# EAGLE design STM32 Proto Shield (EAGLE 9.6.2)
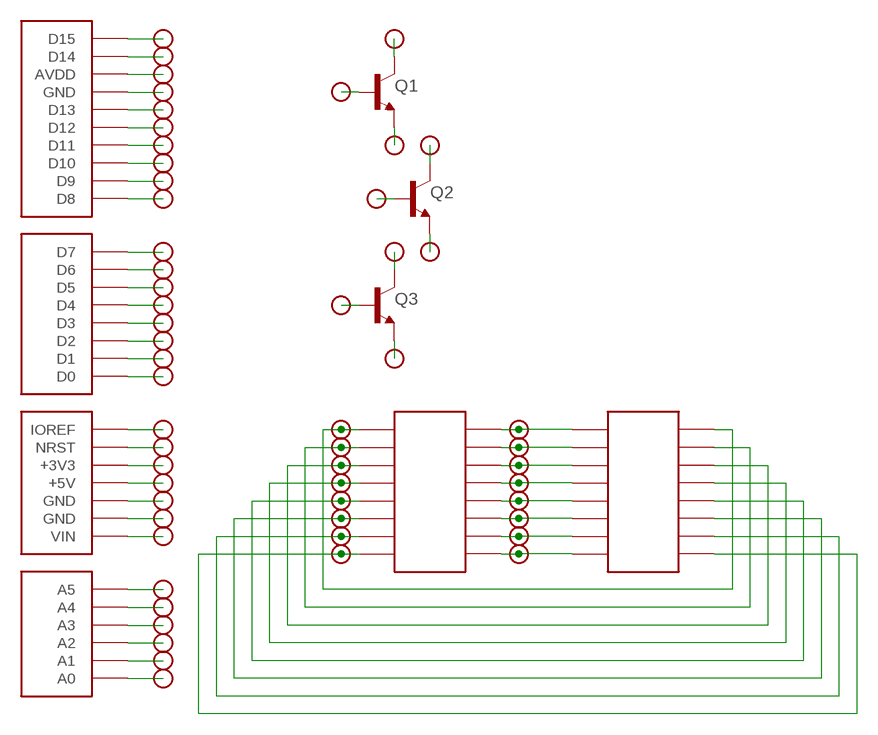
[diagram p0: schematic, sheet 1]

## Parts
J1  DISCO_SHIELD_BARE  [DISCO_SHIELAD_BARE]
Q1  BC817-40SMD  [SOT23-BEC]
Q2  BC817-40SMD  [SOT23-BEC]
Q3  BC817-40SMD  [SOT23-BEC]
U$1  SOLDER_PAD  [1_08X19]
U$2  SOLDER_PAD  [1_08X19]
U$3  SOLDER_PAD  [1_08X19]
U$4  SOLDER_PAD  [1_08X19]
U$5  SOLDER_PAD  [1_08X19]
U$6  SOLDER_PAD  [1_08X19]
U$7  SOLDER_PAD  [1_08X19]
U$8  SOLDER_PAD  [1_08X19]
U$9  SOLDER_PAD  [1_08X19]
U$10  SOLDER_PAD  [1_08X19]
U$11  SOLDER_PAD  [1_08X19]
U$12  SOLDER_PAD  [1_08X19]
U$13  SOLDER_PAD  [1_08X19]
U$14  SOLDER_PAD  [1_08X19]
U$15  SOLDER_PAD  [1_08X19]
U$16  SOLDER_PAD  [1_08X19]
U$17  SOLDER_PAD  [1_08X19]
U$18  SOLDER_PAD  [1_08X19]
U$19  SOLDER_PAD  [1_08X19]
U$20  SOLDER_PAD  [1_08X19]
U$21  SOLDER_PAD  [1_08X19]
U$22  SOLDER_PAD  [1_08X19]
U$23  SOLDER_PAD  [1_08X19]
U$24  SOLDER_PAD  [1_08X19]
U$25  SOLDER_PAD  [1_08X19]
U$26  SOLDER_PAD  [1_08X19]
U$27  SOLDER_PAD  [1_08X19]
U$28  SOLDER_PAD  [1_08X19]
U$29  SOLDER_PAD  [1_08X19]
U$30  SOLDER_PAD  [1_08X19]
U$31  SOLDER_PAD  [1_08X19]
U$32  SOLDER_PAD  [1_08X19]
U$33  SOLDER_PAD  [1_08X19]
U$34  SOLDER_PAD  [1_08X19]
U$35  SOLDER_PAD  [1_08X19]
U$36  SOLDER_PAD  [1_08X19]
U$37  SOLDER_PAD  [1_08X19]
U$38  SOLDER_PAD  [1_08X19]
U$39  SOLDER_PAD  [1_08X19]
U$40  SOLDER_PAD  [1_08X19]
U$41  GENERIC_SMD_16  [16_TSOP_LONG]
U$42  SOLDER_PAD  [1_08X19]
U$43  SOLDER_PAD  [1_08X19]
U$44  SOLDER_PAD  [1_08X19]
U$45  SOLDER_PAD  [1_08X19]
U$46  SOLDER_PAD  [1_08X19]
U$47  SOLDER_PAD  [1_08X19]
U$48  SOLDER_PAD  [1_08X19]
U$49  SOLDER_PAD  [1_08X19]
U$50  SOLDER_PAD  [1_08X19]
U$51  SOLDER_PAD  [1_08X19]
U$52  SOLDER_PAD  [1_08X19]
U$53  SOLDER_PAD  [1_08X19]
U$54  SOLDER_PAD  [1_08X19]
U$55  SOLDER_PAD  [1_08X19]
U$56  SOLDER_PAD  [1_08X19]
U$57  SOLDER_PAD  [1_08X19]
U$58  GENERIC_SMD_16SOIC_LONG  [16_SOIC_LONG]

## Nets
N$24: U$41.P$1 U$42.P$1 U$58.P$16
N$44: U$41.P$2 U$43.P$1 U$58.P$15
N$45: U$41.P$3 U$44.P$1 U$58.P$14
N$57: U$41.P$16 U$57.P$1 U$58.P$1
N$58: U$41.P$15 U$56.P$1 U$58.P$2
N$59: U$41.P$14 U$55.P$1 U$58.P$3
N$60: U$41.P$13 U$54.P$1 U$58.P$4
N$61: U$41.P$12 U$53.P$1 U$58.P$5
N$62: U$41.P$11 U$52.P$1 U$58.P$6
N$63: U$41.P$10 U$51.P$1 U$58.P$7
N$64: U$41.P$9 U$50.P$1 U$58.P$8
N$97: U$41.P$4 U$45.P$1 U$58.P$13
N$102: U$41.P$5 U$46.P$1 U$58.P$12
N$151: U$41.P$6 U$47.P$1 U$58.P$11
N$152: U$41.P$7 U$49.P$1 U$58.P$10
N$485: J1.D15(J$2:D15) U$1.P$1
N$486: J1.D14(J$2:D14) U$2.P$1
N$489: J1.AVDD(J$2:AVDD) U$3.P$1
N$490: J1.GND_D(J$2:GND) U$4.P$1
N$497: J1.D13(J$2:D13) U$5.P$1
N$510: J1.D12(J$2:D12) U$6.P$1
N$511: J1.D11(J$2:D11) U$7.P$1
N$512: J1.D10(J$2:D10) U$8.P$1
N$513: J1.D9(J$2:D9) U$9.P$1
N$514: J1.D8(J$2:D8) U$10.P$1
N$515: J1.D7(J$1:D7) U$11.P$1
N$516: J1.D6(J$1:D6) U$12.P$1
N$517: J1.D5(J$1:D5) U$13.P$1
N$518: J1.D4(J$1:D4) U$14.P$1
N$519: J1.D3(J$1:D3) U$15.P$1
N$520: J1.D2(J$1:D2) U$16.P$1
N$521: J1.D1(J$1:D1) U$17.P$1
N$522: J1.D0(J$1:D0) U$18.P$1
N$523: J1.IOREF U$19.P$1
N$524: J1.RST(NRST) U$20.P$1
N$525: J1.3V3(+3V3) U$21.P$1
N$526: J1.5V(+5V) U$22.P$1
N$527: J1.GND@2(GND) U$23.P$1
N$528: J1.GND@1(GND) U$24.P$1
N$529: J1.VIN U$25.P$1
N$530: J1.A5 U$26.P$1
N$531: J1.A4 U$27.P$1
N$532: J1.A3 U$28.P$1
N$533: J1.A2 U$29.P$1
N$534: J1.A1 U$30.P$1
N$535: J1.A0 U$31.P$1
N$536: Q1.C U$32.P$1
N$537: Q1.B U$33.P$1
N$538: Q1.E U$34.P$1
N$539: Q2.C U$35.P$1
N$540: Q2.B U$37.P$1
N$541: Q2.E U$36.P$1
N$542: Q3.C U$38.P$1
N$543: Q3.B U$40.P$1
N$544: Q3.E U$39.P$1
N$545: U$41.P$8 U$48.P$1 U$58.P$9

## Library data of the parts
J1 = kcs-proto:DISCO_SHIELD_BARE: Generic shield pinhead layout for STM32 Discovery boards
Q1-Q3 = transistor-npn:BC817*: NPN Transistor
U$1-U$40 U$42-U$57 = kcs-proto:SOLDER_PAD
U$41 U$58 = kcs-proto:GENERIC_SMD_16

## Board
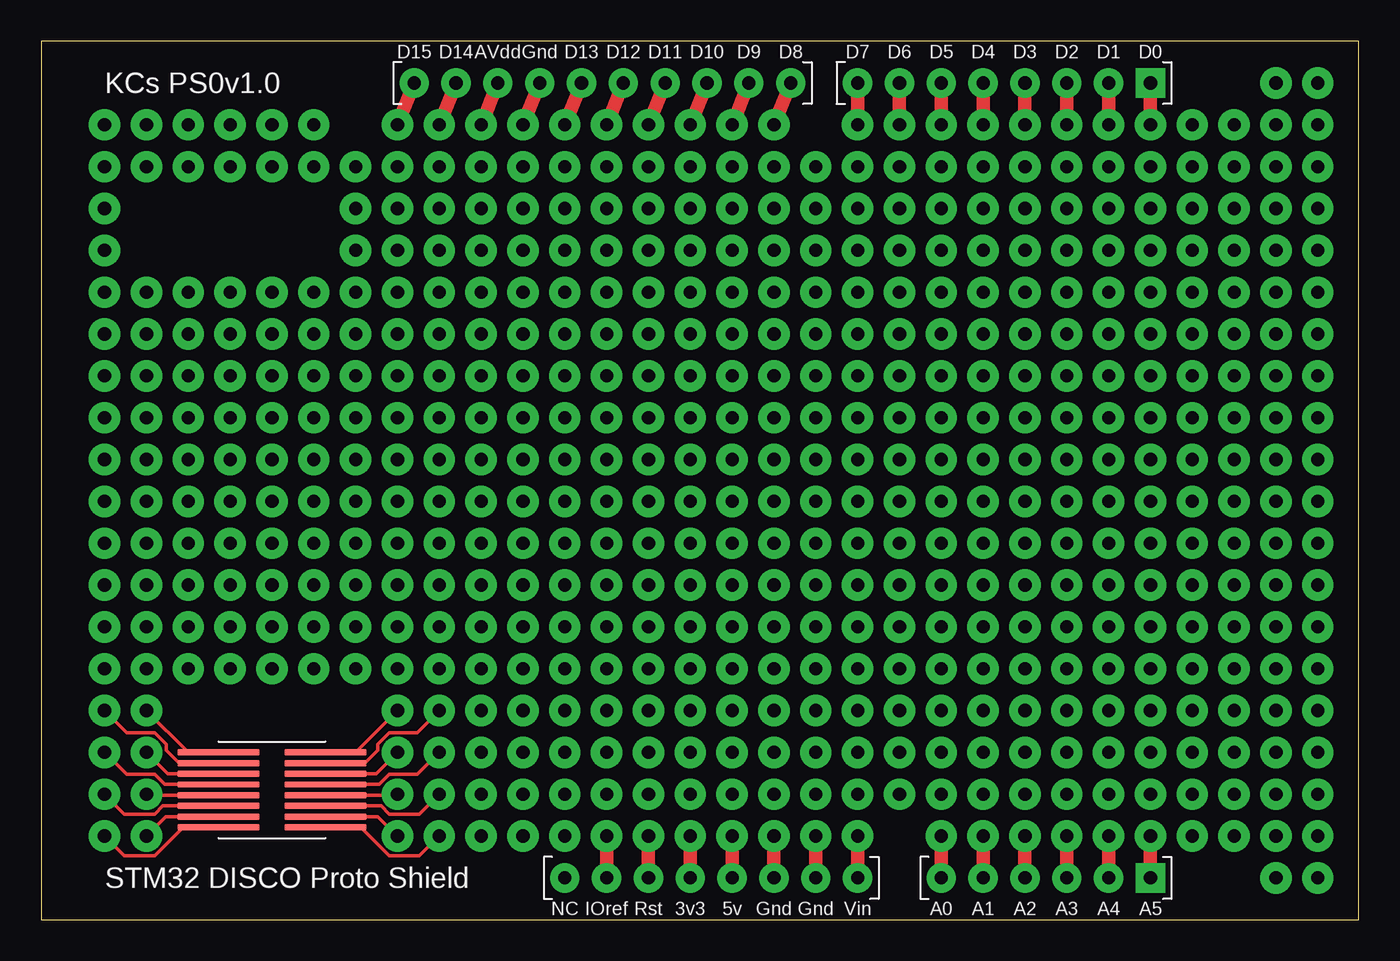
[diagram p1: board, top side]
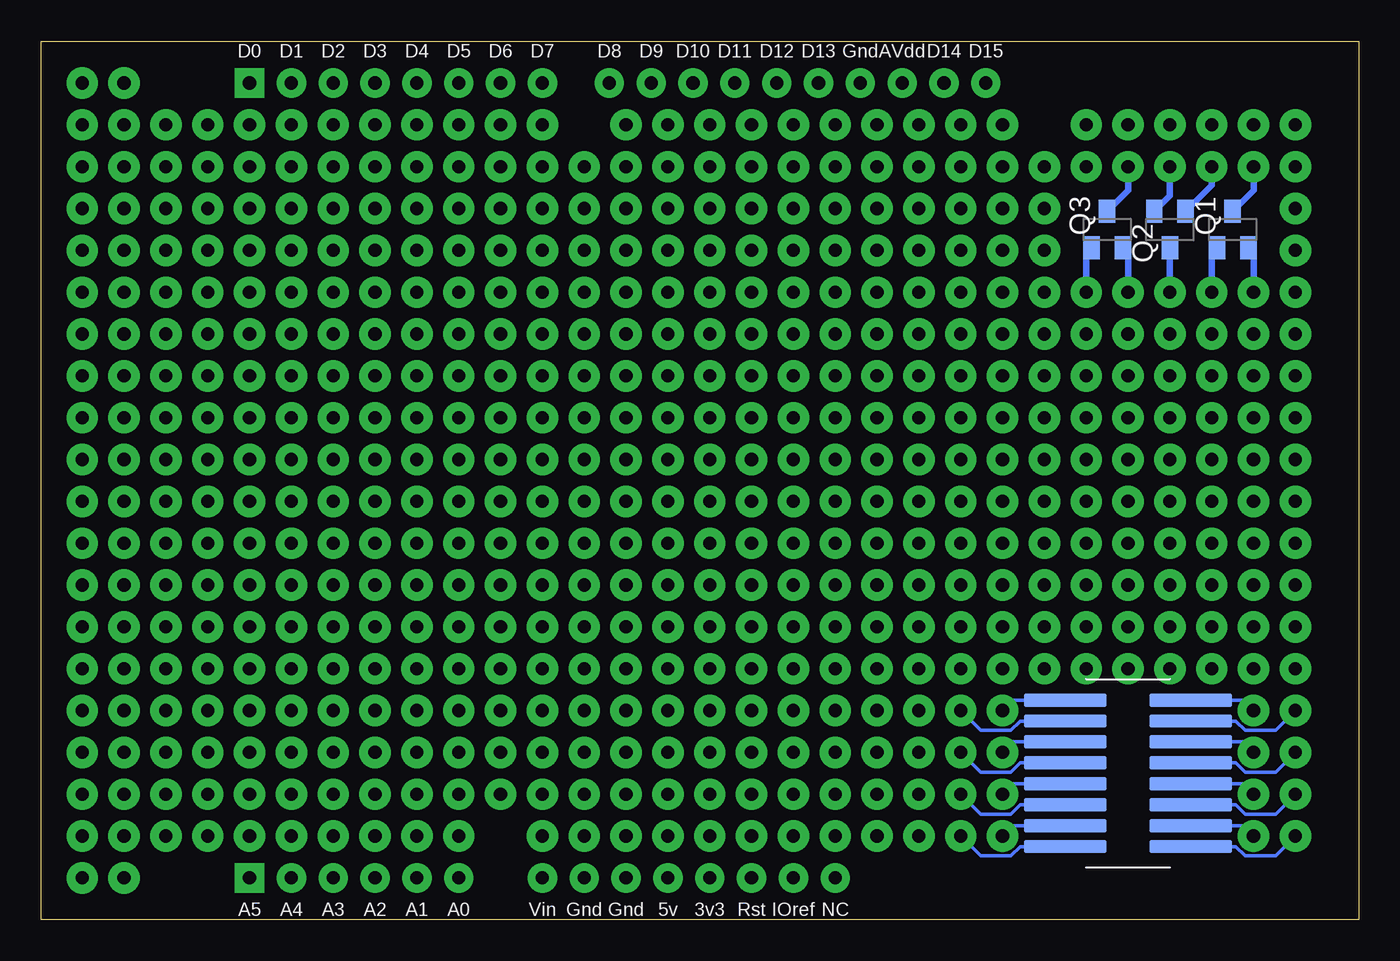
[diagram p2: board, bottom side, seen from below]

Size 80 x 53.34 mm. Coordinates in mm from the lower left corner, seen from the top.
Outline: 0,0 80,0 80,53.34 0,53.34 0,0
Copper layers (1*16): Top 0.035mm / dielectric 1.5mm / Bottom 0.035mm
Design rules "default": minimum track width 6mil, minimum drill 0.35mm, track to track 6mil, track to pad 6mil, pad to pad 6mil, via to via 6mil, smd to smd 6mil, copper to edge 40mil, drill to drill 6mil, minimum pad ring 10mil, minimum via ring 8mil, stop-mask expansion 4mil, vias tented up to drill 0mil, thermal gap 10mil

### Footprints (pad centres in the part's own frame; a part is rotated, then mirrored left to right if it is on the bottom)
DISCO_SHIELAD_BARE = drill 0.8 pad 1.778: 3V3 48.26,-27.94; 5V 48.26,-25.4; A0 48.26,-12.7; A1 48.26,-10.16; A2 48.26,-7.62; A3 48.26,-5.08; A4 48.26,-2.54; AVDD 0,-39.624; D1 0,-2.54; D2 0,-5.08; D3 0,-7.62; D4 0,-10.16; D5 0,-12.7; D6 0,-15.24; D7 0,-17.78; D8 0,-21.844; D9 0,-24.384; D10 0,-26.924; D11 0,-29.464; D12 0,-32.004; D13 0,-34.544; D14 0,-42.164; D15 0,-44.704; GND@1 48.26,-20.32; GND@2 48.26,-22.86; GND_D 0,-37.084; IOREF 48.26,-33.02; P$32 48.26,-35.56; RST 48.26,-30.48; VIN 48.26,-17.78 | drill 0.8 pad 1.778 square: A5 48.26,0; D0 0,0
SOT23-BEC = smd 1 x 1.4: B -0.95,-1.1; C 0,1.1; E 0.95,-1.1
1_08X19 = drill 0.8 pad 1.9: P$1 0,0
16_TSOP_LONG = smd 5 x 0.4: P$1 -3.25,0; P$2 -3.25,-0.65; P$3 -3.25,-1.3; P$4 -3.25,-1.95; P$5 -3.25,-2.6; P$6 -3.25,-3.25; P$7 -3.25,-3.9; P$8 -3.25,-4.55; P$9 3.25,-4.55; P$10 3.25,-3.9; P$11 3.25,-3.25; P$12 3.25,-2.6; P$13 3.25,-1.95; P$14 3.25,-1.3; P$15 3.25,-0.65; P$16 3.25,0
16_SOIC_LONG = smd 5 x 0.8: P$1 -3.81,0; P$2 -3.81,-1.27; P$3 -3.81,-2.54; P$4 -3.81,-3.81; P$5 -3.81,-5.08; P$6 -3.81,-6.35; P$7 -3.81,-7.62; P$8 -3.81,-8.89; P$9 3.81,-8.89; P$10 3.81,-7.62; P$11 3.81,-6.35; P$12 3.81,-5.08; P$13 3.81,-3.81; P$14 3.81,-2.54; P$15 3.81,-1.27; P$16 3.81,0

### Placement (x,y rotation side)
J1  67.35,50.8 270 top
Q1  7.66,41.91 0 bottom
Q2  11.47,41.91 180 bottom
Q3  15.28,41.91 0 bottom
U$1  21.63,48.26 0 top
U$2  24.17,48.26 0 top
U$3  26.71,48.26 0 top
U$4  29.25,48.26 0 top
U$5  31.79,48.26 0 top
U$6  34.33,48.26 0 top
U$7  36.87,48.26 0 top
U$8  39.41,48.26 0 top
U$9  41.95,48.26 0 top
U$10  44.49,48.26 0 top
U$11  49.57,48.26 0 top
U$12  52.11,48.26 0 top
U$13  54.65,48.26 0 top
U$14  57.19,48.26 0 top
U$15  59.73,48.26 0 top
U$16  62.27,48.26 0 top
U$17  64.81,48.26 0 top
U$18  67.35,48.26 0 top
U$19  34.33,5.08 0 top
U$20  36.87,5.08 0 top
U$21  39.41,5.08 0 top
U$22  41.95,5.08 0 top
U$23  44.49,5.08 0 top
U$24  47.03,5.08 0 top
U$25  49.57,5.08 0 top
U$26  67.35,5.08 0 top
U$27  64.81,5.08 0 top
U$28  62.27,5.08 0 top
U$29  59.73,5.08 0 top
U$30  57.19,5.08 0 top
U$31  54.65,5.08 0 top
U$32  6.39,45.72 0 top
U$33  8.93,38.1 0 top
U$34  6.39,38.1 0 top
U$35  11.47,38.1 0 top
U$36  11.47,45.72 0 top
U$37  8.93,45.72 0 top
U$38  14.01,45.72 0 top
U$39  14.01,38.1 0 top
U$40  16.55,38.1 0 top
U$41  14.01,10.16 0 top
U$42  6.39,12.7 0 top
U$43  3.85,12.7 0 top
U$44  6.39,10.16 0 top
U$45  3.85,10.16 0 top
U$46  6.39,7.62 0 top
U$47  3.85,7.62 0 top
U$48  3.85,5.08 0 top
U$49  6.39,5.08 0 top
U$50  24.17,5.08 0 top
U$51  21.63,5.08 0 top
U$52  24.17,7.62 0 top
U$53  21.63,7.62 0 top
U$54  24.17,10.16 0 top
U$55  21.63,10.16 0 top
U$56  24.17,12.7 0 top
U$57  21.63,12.7 0 top
U$58  14.01,13.34 0 bottom

### Tracks (layer width: path | path; a pad name or v marks a point on that pad's centre or on a via)
N$1  (via drill 0.8 pad 1.9)
  other vias: 67.35,45.72
N$2  (via drill 0.8 pad 1.9)
  other vias: 64.81,45.72
N$3  (via drill 0.8 pad 1.9)
  other vias: 62.27,45.72
N$4  (via drill 0.8 pad 1.9)
  other vias: 59.73,45.72
N$5  (via drill 0.8 pad 1.9)
  other vias: 57.19,45.72
N$6  (via drill 0.8 pad 1.9)
  other vias: 54.65,45.72
N$7  (via drill 0.8 pad 1.9)
  other vias: 52.11,45.72
N$8  (via drill 0.8 pad 1.9)
  other vias: 49.57,45.72
N$9  (via drill 0.8 pad 1.9)
  other vias: 47.03,45.72
N$10  (via drill 0.8 pad 1.9)
  other vias: 44.49,45.72
N$11  (via drill 0.8 pad 1.9)
  other vias: 41.95,45.72
N$12  (via drill 0.8 pad 1.9)
  other vias: 39.41,45.72
N$13  (via drill 0.8 pad 1.9)
  other vias: 36.87,45.72
N$14  (via drill 0.8 pad 1.9)
  other vias: 34.33,45.72
N$15  (via drill 0.8 pad 1.9)
  other vias: 31.79,45.72
N$16  (via drill 0.8 pad 1.9)
  other vias: 29.25,45.72
N$17  (via drill 0.8 pad 1.9)
  other vias: 26.71,45.72
N$18  (via drill 0.8 pad 1.9)
  other vias: 24.17,45.72
N$19  (via drill 0.8 pad 1.9)
  other vias: 21.63,45.72
N$20  (via drill 0.8 pad 1.9)
  other vias: 19.09,45.72
N$24
  Top 0.203: U$41.P$1 8.93,10.16 U$42.P$1
  Bottom 0.203: U$58.P$16 7.03,13.34 U$42.P$1
N$25  (via drill 0.8 pad 1.9)
  other vias: 16.55,45.72
N$26  (via drill 0.8 pad 1.9)
  other vias: 3.85,45.72
N$27  (via drill 0.8 pad 1.9)
  other vias: 69.89,45.72
N$28  (via drill 0.8 pad 1.9)
  other vias: 72.43,45.72
N$29  (via drill 0.8 pad 1.9)
  other vias: 74.97,45.72
N$30  (via drill 0.8 pad 1.9)
  other vias: 77.51,45.72
N$31  (via drill 0.8 pad 1.9)
  other vias: 77.51,43.18
N$32  (via drill 0.8 pad 1.9)
  other vias: 74.97,43.18
N$33  (via drill 0.8 pad 1.9)
  other vias: 77.51,40.64
N$34  (via drill 0.8 pad 1.9)
  other vias: 74.97,40.64
N$35  (via drill 0.8 pad 1.9)
  other vias: 77.51,38.1
N$36  (via drill 0.8 pad 1.9)
  other vias: 74.97,38.1
N$37  (via drill 0.8 pad 1.9)
  other vias: 77.51,35.56
N$38  (via drill 0.8 pad 1.9)
  other vias: 74.97,35.56
N$39  (via drill 0.8 pad 1.9)
  other vias: 77.51,33.02
N$40  (via drill 0.8 pad 1.9)
  other vias: 74.97,33.02
N$41  (via drill 0.8 pad 1.9)
  other vias: 77.51,30.48
N$42  (via drill 0.8 pad 1.9)
  other vias: 74.97,30.48
N$43  (via drill 0.8 pad 1.9)
  other vias: 3.85,43.18
N$44
  Top 0.203: U$41.P$2 8.38,9.51 7.59,10.3 7.59,10.66 6.89,11.36 5.19,11.36 U$43.P$1
  Bottom 0.203: U$58.P$15 7.46,12.06 6.89,11.5 5.05,11.5 U$43.P$1
N$45
  Top 0.203: U$41.P$3 7.69,8.86 U$44.P$1
  Bottom 0.203: U$58.P$14 7.03,10.79 U$44.P$1
N$46  (via drill 0.8 pad 1.9)
  other vias: 3.85,40.64
N$47  (via drill 0.8 pad 1.9)
  other vias: 3.85,38.1
N$48  (via drill 0.8 pad 1.9)
  other vias: 3.85,35.56
N$49  (via drill 0.8 pad 1.9)
  other vias: 3.85,33.02
N$50  (via drill 0.8 pad 1.9)
  other vias: 3.85,30.48
N$51  (via drill 0.8 pad 1.9)
  other vias: 3.85,27.94
N$52  (via drill 0.8 pad 1.9)
  other vias: 3.85,25.4
N$53  (via drill 0.8 pad 1.9)
  other vias: 3.85,22.86
N$54  (via drill 0.8 pad 1.9)
  other vias: 3.85,20.32
N$55  (via drill 0.8 pad 1.9)
  other vias: 3.85,17.78
N$56  (via drill 0.8 pad 1.9)
  other vias: 3.85,15.24
N$57
  Top 0.203: U$41.P$16 19.09,10.16 U$57.P$1
  Bottom 0.203: U$57.P$1 21,13.34 U$58.P$1
N$58
  Top 0.203: U$41.P$15 19.64,9.51 20.43,10.3 20.43,10.66 21.13,11.36 22.83,11.36 U$56.P$1
  Bottom 0.203: 18.02,12.06 U$58.P$2 20.56,12.06 21.13,11.5 22.97,11.5 U$56.P$1
N$59
  Top 0.203: U$41.P$14 20.33,8.86 U$55.P$1
  Bottom 0.203: U$58.P$3 21,10.79 U$55.P$1
N$60
  Top 0.203: U$41.P$13 20.52,8.21 21.13,8.82 22.83,8.82 U$54.P$1
  Bottom 0.203: U$58.P$4 20.56,9.53 21.13,8.96 22.97,8.96 U$54.P$1
N$61
  Top 0.203: U$41.P$12 21.57,7.56 U$53.P$1
  Bottom 0.203: U$58.P$5 21,8.26 U$53.P$1
N$62
  Top 0.203: U$41.P$11 20.64,6.91 21.13,6.42 22.97,6.42 U$52.P$1
  Bottom 0.203: U$58.P$6 20.56,6.99 21.13,6.42 22.97,6.42 U$52.P$1
N$63
  Top 0.203: U$41.P$10 20.45,6.26 U$51.P$1
  Bottom 0.203: U$58.P$7 21,5.71 U$51.P$1
N$64
  Top 0.203: U$41.P$9 19.4,5.61 21.13,3.88 22.97,3.88 U$50.P$1
  Bottom 0.203: U$58.P$8 20.56,4.45 21.13,3.88 22.97,3.88 U$50.P$1
N$68  (via drill 0.8 pad 1.9)
  other vias: 26.71,7.62
N$69  (via drill 0.8 pad 1.9)
  other vias: 29.25,7.62
N$70  (via drill 0.8 pad 1.9)
  other vias: 31.79,7.62
N$71  (via drill 0.8 pad 1.9)
  other vias: 34.33,7.62
N$72  (via drill 0.8 pad 1.9)
  other vias: 36.87,7.62
N$73  (via drill 0.8 pad 1.9)
  other vias: 39.41,7.62
N$74  (via drill 0.8 pad 1.9)
  other vias: 41.95,7.62
N$75  (via drill 0.8 pad 1.9)
  other vias: 44.49,7.62
N$76  (via drill 0.8 pad 1.9)
  other vias: 47.03,7.62
N$77  (via drill 0.8 pad 1.9)
  other vias: 49.57,7.62
N$78  (via drill 0.8 pad 1.9)
  other vias: 52.11,7.62
N$79  (via drill 0.8 pad 1.9)
  other vias: 54.65,7.62
N$80  (via drill 0.8 pad 1.9)
  other vias: 57.19,7.62
N$81  (via drill 0.8 pad 1.9)
  other vias: 59.73,7.62
N$82  (via drill 0.8 pad 1.9)
  other vias: 62.27,7.62
N$83  (via drill 0.8 pad 1.9)
  other vias: 64.81,7.62
N$84  (via drill 0.8 pad 1.9)
  other vias: 67.35,7.62
N$85  (via drill 0.8 pad 1.9)
  other vias: 69.89,7.62
N$86  (via drill 0.8 pad 1.9)
  other vias: 72.43,7.62
N$87  (via drill 0.8 pad 1.9)
  other vias: 74.97,7.62
N$88  (via drill 0.8 pad 1.9)
  other vias: 77.51,7.62
N$89  (via drill 0.8 pad 1.9)
  other vias: 77.51,10.16
N$90  (via drill 0.8 pad 1.9)
  other vias: 77.51,12.7
N$91  (via drill 0.8 pad 1.9)
  other vias: 77.51,15.24
N$92  (via drill 0.8 pad 1.9)
  other vias: 77.51,17.78
N$93  (via drill 0.8 pad 1.9)
  other vias: 77.51,20.32
N$94  (via drill 0.8 pad 1.9)
  other vias: 77.51,22.86
N$95  (via drill 0.8 pad 1.9)
  other vias: 77.51,25.4
N$96  (via drill 0.8 pad 1.9)
  other vias: 77.51,27.94
N$97
  Top 0.203: U$41.P$4 7.5,8.21 6.89,8.82 5.19,8.82 U$45.P$1
  Bottom 0.203: U$58.P$13 7.46,9.53 6.89,8.96 5.05,8.96 U$45.P$1
N$99  (via drill 0.8 pad 1.9)
  other vias: 6.39,35.56
N$100  (via drill 0.8 pad 1.9)
  other vias: 6.39,33.02
N$101  (via drill 0.8 pad 1.9)
  other vias: 6.39,30.48
N$102
  Top 0.203: U$41.P$5 6.45,7.56 U$46.P$1
  Bottom 0.203: U$58.P$12 7.03,8.26 U$46.P$1
N$103  (via drill 0.8 pad 1.9)
  other vias: 8.93,48.26
N$104  (via drill 0.8 pad 1.9)
  other vias: 16.55,48.26
N$105  (via drill 0.8 pad 1.9)
  other vias: 19.09,43.18
N$106  (via drill 0.8 pad 1.9)
  other vias: 21.63,43.18
N$107  (via drill 0.8 pad 1.9)
  other vias: 24.17,43.18
N$108  (via drill 0.8 pad 1.9)
  other vias: 26.71,43.18
N$109  (via drill 0.8 pad 1.9)
  other vias: 29.25,43.18
N$110  (via drill 0.8 pad 1.9)
  other vias: 31.79,43.18
N$111  (via drill 0.8 pad 1.9)
  other vias: 34.33,43.18
N$112  (via drill 0.8 pad 1.9)
  other vias: 36.87,43.18
N$113  (via drill 0.8 pad 1.9)
  other vias: 39.41,43.18
N$114  (via drill 0.8 pad 1.9)
  other vias: 41.95,43.18
N$115  (via drill 0.8 pad 1.9)
  other vias: 44.49,43.18
N$116  (via drill 0.8 pad 1.9)
  other vias: 47.03,43.18
N$117  (via drill 0.8 pad 1.9)
  other vias: 49.57,43.18
N$118  (via drill 0.8 pad 1.9)
  other vias: 52.11,43.18
N$119  (via drill 0.8 pad 1.9)
  other vias: 54.65,43.18
N$120  (via drill 0.8 pad 1.9)
  other vias: 57.19,43.18
N$121  (via drill 0.8 pad 1.9)
  other vias: 59.73,43.18
N$122  (via drill 0.8 pad 1.9)
  other vias: 62.27,40.64
N$123  (via drill 0.8 pad 1.9)
  other vias: 62.27,43.18
N$124  (via drill 0.8 pad 1.9)
  other vias: 64.81,43.18
N$125  (via drill 0.8 pad 1.9)
  other vias: 67.35,43.18
N$126  (via drill 0.8 pad 1.9)
  other vias: 69.89,43.18
N$127  (via drill 0.8 pad 1.9)
  other vias: 72.43,43.18
N$128  (via drill 0.8 pad 1.9)
  other vias: 72.43,40.64
N$129  (via drill 0.8 pad 1.9)
  other vias: 69.89,40.64
N$130  (via drill 0.8 pad 1.9)
  other vias: 67.35,40.64
N$131  (via drill 0.8 pad 1.9)
  other vias: 64.81,40.64
N$132  (via drill 0.8 pad 1.9)
  other vias: 59.73,40.64
N$133  (via drill 0.8 pad 1.9)
  other vias: 57.19,40.64
N$134  (via drill 0.8 pad 1.9)
  other vias: 54.65,40.64
N$135  (via drill 0.8 pad 1.9)
  other vias: 52.11,40.64
N$136  (via drill 0.8 pad 1.9)
  other vias: 49.57,40.64
N$137  (via drill 0.8 pad 1.9)
  other vias: 47.03,40.64
N$138  (via drill 0.8 pad 1.9)
  other vias: 44.49,40.64
N$139  (via drill 0.8 pad 1.9)
  other vias: 39.41,40.64
N$140  (via drill 0.8 pad 1.9)
  other vias: 41.95,40.64
N$141  (via drill 0.8 pad 1.9)
  other vias: 36.87,40.64
N$142  (via drill 0.8 pad 1.9)
  other vias: 34.33,40.64
N$143  (via drill 0.8 pad 1.9)
  other vias: 31.79,40.64
N$144  (via drill 0.8 pad 1.9)
  other vias: 29.25,40.64
N$145  (via drill 0.8 pad 1.9)
  other vias: 26.71,40.64
N$146  (via drill 0.8 pad 1.9)
  other vias: 24.17,40.64
N$147  (via drill 0.8 pad 1.9)
  other vias: 21.63,40.64
N$148  (via drill 0.8 pad 1.9)
  other vias: 19.09,40.64
N$149  (via drill 0.8 pad 1.9)
  other vias: 11.47,48.26
N$150  (via drill 0.8 pad 1.9)
  other vias: 14.01,48.26
N$151
  Top 0.203: U$41.P$6 7.38,6.91 6.89,6.42 5.05,6.42 U$47.P$1
  Bottom 0.203: U$58.P$11 7.46,6.99 6.89,6.42 5.05,6.42 U$47.P$1
N$152
  Top 0.203: U$41.P$7 7.57,6.26 U$49.P$1
  Bottom 0.203: U$58.P$10 7.03,5.71 U$49.P$1
N$153  (via drill 0.8 pad 1.9)
  other vias: 3.85,48.26
N$156  (via drill 0.8 pad 1.9)
  other vias: 6.39,48.26
N$157  (via drill 0.8 pad 1.9)
  other vias: 19.09,38.1
N$158  (via drill 0.8 pad 1.9)
  other vias: 21.63,38.1
N$159  (via drill 0.8 pad 1.9)
  other vias: 24.17,38.1
N$160  (via drill 0.8 pad 1.9)
  other vias: 26.71,38.1
N$161  (via drill 0.8 pad 1.9)
  other vias: 29.25,38.1
N$162  (via drill 0.8 pad 1.9)
  other vias: 31.79,38.1
N$163  (via drill 0.8 pad 1.9)
  other vias: 34.33,38.1
N$164  (via drill 0.8 pad 1.9)
  other vias: 36.87,38.1
N$165  (via drill 0.8 pad 1.9)
  other vias: 41.95,38.1
N$166  (via drill 0.8 pad 1.9)
  other vias: 39.41,38.1
N$167  (via drill 0.8 pad 1.9)
  other vias: 44.49,38.1
N$168  (via drill 0.8 pad 1.9)
  other vias: 47.03,38.1
N$169  (via drill 0.8 pad 1.9)
  other vias: 49.57,38.1
N$170  (via drill 0.8 pad 1.9)
  other vias: 52.11,38.1
N$171  (via drill 0.8 pad 1.9)
  other vias: 57.19,38.1
N$172  (via drill 0.8 pad 1.9)
  other vias: 54.65,38.1
N$173  (via drill 0.8 pad 1.9)
  other vias: 59.73,38.1
N$174  (via drill 0.8 pad 1.9)
  other vias: 62.27,38.1
N$175  (via drill 0.8 pad 1.9)
  other vias: 64.81,38.1
N$176  (via drill 0.8 pad 1.9)
  other vias: 67.35,38.1
N$177  (via drill 0.8 pad 1.9)
  other vias: 69.89,38.1
N$178  (via drill 0.8 pad 1.9)
  other vias: 72.43,38.1
N$179  (via drill 0.8 pad 1.9)
  other vias: 72.43,35.56
N$180  (via drill 0.8 pad 1.9)
  other vias: 69.89,35.56
N$181  (via drill 0.8 pad 1.9)
  other vias: 67.35,35.56
N$182  (via drill 0.8 pad 1.9)
  other vias: 64.81,35.56
N$183  (via drill 0.8 pad 1.9)
  other vias: 62.27,35.56
N$184  (via drill 0.8 pad 1.9)
  other vias: 59.73,35.56
N$185  (via drill 0.8 pad 1.9)
  other vias: 57.19,35.56
N$186  (via drill 0.8 pad 1.9)
  other vias: 54.65,35.56
N$187  (via drill 0.8 pad 1.9)
  other vias: 52.11,35.56
N$188  (via drill 0.8 pad 1.9)
  other vias: 49.57,35.56
N$189  (via drill 0.8 pad 1.9)
  other vias: 47.03,35.56
N$190  (via drill 0.8 pad 1.9)
  other vias: 44.49,35.56
N$191  (via drill 0.8 pad 1.9)
  other vias: 41.95,35.56
N$192  (via drill 0.8 pad 1.9)
  other vias: 39.41,35.56
N$193  (via drill 0.8 pad 1.9)
  other vias: 36.87,35.56
N$194  (via drill 0.8 pad 1.9)
  other vias: 34.33,35.56
N$195  (via drill 0.8 pad 1.9)
  other vias: 31.79,35.56
N$196  (via drill 0.8 pad 1.9)
  other vias: 29.25,35.56
N$197  (via drill 0.8 pad 1.9)
  other vias: 26.71,35.56
N$198  (via drill 0.8 pad 1.9)
  other vias: 24.17,35.56
N$199  (via drill 0.8 pad 1.9)
  other vias: 21.63,35.56
N$200  (via drill 0.8 pad 1.9)
  other vias: 19.09,35.56
N$201  (via drill 0.8 pad 1.9)
  other vias: 16.55,35.56
N$202  (via drill 0.8 pad 1.9)
  other vias: 14.01,35.56
N$203  (via drill 0.8 pad 1.9)
  other vias: 11.47,35.56
N$204  (via drill 0.8 pad 1.9)
  other vias: 8.93,35.56
N$205  (via drill 0.8 pad 1.9)
  other vias: 8.93,33.02
N$206  (via drill 0.8 pad 1.9)
  other vias: 11.47,33.02
N$207  (via drill 0.8 pad 1.9)
  other vias: 14.01,33.02
N$208  (via drill 0.8 pad 1.9)
  other vias: 16.55,33.02
N$209  (via drill 0.8 pad 1.9)
  other vias: 19.09,33.02
N$210  (via drill 0.8 pad 1.9)
  other vias: 21.63,33.02
N$211  (via drill 0.8 pad 1.9)
  other vias: 24.17,33.02
N$212  (via drill 0.8 pad 1.9)
  other vias: 26.71,33.02
N$213  (via drill 0.8 pad 1.9)
  other vias: 29.25,33.02
N$214  (via drill 0.8 pad 1.9)
  other vias: 31.79,33.02
N$215  (via drill 0.8 pad 1.9)
  other vias: 34.33,33.02
N$216  (via drill 0.8 pad 1.9)
  other vias: 36.87,33.02
N$217  (via drill 0.8 pad 1.9)
  other vias: 39.41,33.02
N$218  (via drill 0.8 pad 1.9)
  other vias: 41.95,33.02
N$219  (via drill 0.8 pad 1.9)
  other vias: 44.49,33.02
N$220  (via drill 0.8 pad 1.9)
  other vias: 47.03,33.02
N$221  (via drill 0.8 pad 1.9)
  other vias: 49.57,33.02
N$222  (via drill 0.8 pad 1.9)
  other vias: 52.11,33.02
N$223  (via drill 0.8 pad 1.9)
  other vias: 54.65,33.02
N$224  (via drill 0.8 pad 1.9)
  other vias: 57.19,33.02
N$225  (via drill 0.8 pad 1.9)
  other vias: 59.73,33.02
N$226  (via drill 0.8 pad 1.9)
  other vias: 62.27,33.02
N$227  (via drill 0.8 pad 1.9)
  other vias: 64.81,33.02
N$228  (via drill 0.8 pad 1.9)
  other vias: 67.35,33.02
N$229  (via drill 0.8 pad 1.9)
  other vias: 69.89,33.02
N$230  (via drill 0.8 pad 1.9)
  other vias: 72.43,33.02
N$231  (via drill 0.8 pad 1.9)
  other vias: 72.43,30.48
N$232  (via drill 0.8 pad 1.9)
  other vias: 69.89,30.48
N$233  (via drill 0.8 pad 1.9)
  other vias: 67.35,30.48
N$234  (via drill 0.8 pad 1.9)
  other vias: 64.81,30.48
N$235  (via drill 0.8 pad 1.9)
  other vias: 62.27,30.48
N$236  (via drill 0.8 pad 1.9)
  other vias: 59.73,30.48
N$237  (via drill 0.8 pad 1.9)
  other vias: 57.19,30.48
N$238  (via drill 0.8 pad 1.9)
  other vias: 54.65,30.48
N$239  (via drill 0.8 pad 1.9)
  other vias: 52.11,30.48
N$240  (via drill 0.8 pad 1.9)
  other vias: 49.57,30.48
N$241  (via drill 0.8 pad 1.9)
  other vias: 47.03,30.48
N$242  (via drill 0.8 pad 1.9)
  other vias: 44.49,30.48
N$243  (via drill 0.8 pad 1.9)
  other vias: 41.95,30.48
N$244  (via drill 0.8 pad 1.9)
  other vias: 39.41,30.48
N$245  (via drill 0.8 pad 1.9)
  other vias: 36.87,30.48
N$246  (via drill 0.8 pad 1.9)
  other vias: 34.33,30.48
N$247  (via drill 0.8 pad 1.9)
  other vias: 31.79,30.48
N$248  (via drill 0.8 pad 1.9)
  other vias: 29.25,30.48
N$249  (via drill 0.8 pad 1.9)
  other vias: 26.71,30.48
N$250  (via drill 0.8 pad 1.9)
  other vias: 24.17,30.48
N$251  (via drill 0.8 pad 1.9)
  other vias: 21.63,30.48
N$252  (via drill 0.8 pad 1.9)
  other vias: 19.09,30.48
N$253  (via drill 0.8 pad 1.9)
  other vias: 16.55,30.48
N$254  (via drill 0.8 pad 1.9)
  other vias: 14.01,30.48
N$255  (via drill 0.8 pad 1.9)
  other vias: 11.47,30.48
N$256  (via drill 0.8 pad 1.9)
  other vias: 8.93,30.48
N$257  (via drill 0.8 pad 1.9)
  other vias: 6.39,27.94
N$258  (via drill 0.8 pad 1.9)
  other vias: 8.93,27.94
N$259  (via drill 0.8 pad 1.9)
  other vias: 11.47,27.94
N$260  (via drill 0.8 pad 1.9)
  other vias: 14.01,27.94
N$261  (via drill 0.8 pad 1.9)
  other vias: 16.55,27.94
N$262  (via drill 0.8 pad 1.9)
  other vias: 19.09,27.94
N$263  (via drill 0.8 pad 1.9)
  other vias: 21.63,27.94
N$264  (via drill 0.8 pad 1.9)
  other vias: 24.17,27.94
N$265  (via drill 0.8 pad 1.9)
  other vias: 26.71,27.94
N$266  (via drill 0.8 pad 1.9)
  other vias: 29.25,27.94
N$267  (via drill 0.8 pad 1.9)
  other vias: 31.79,27.94
N$268  (via drill 0.8 pad 1.9)
  other vias: 34.33,27.94
N$269  (via drill 0.8 pad 1.9)
  other vias: 36.87,27.94
N$270  (via drill 0.8 pad 1.9)
  other vias: 39.41,27.94
N$271  (via drill 0.8 pad 1.9)
  other vias: 41.95,27.94
N$272  (via drill 0.8 pad 1.9)
  other vias: 44.49,27.94
N$273  (via drill 0.8 pad 1.9)
  other vias: 47.03,27.94
N$274  (via drill 0.8 pad 1.9)
  other vias: 49.57,27.94
N$275  (via drill 0.8 pad 1.9)
  other vias: 52.11,27.94
N$276  (via drill 0.8 pad 1.9)
  other vias: 54.65,27.94
N$277  (via drill 0.8 pad 1.9)
  other vias: 57.19,27.94
N$278  (via drill 0.8 pad 1.9)
  other vias: 59.73,27.94
N$279  (via drill 0.8 pad 1.9)
  other vias: 62.27,27.94
N$280  (via drill 0.8 pad 1.9)
  other vias: 64.81,27.94
N$281  (via drill 0.8 pad 1.9)
  other vias: 67.35,27.94
N$282  (via drill 0.8 pad 1.9)
  other vias: 69.89,27.94
N$283  (via drill 0.8 pad 1.9)
  other vias: 72.43,27.94
N$284  (via drill 0.8 pad 1.9)
  other vias: 74.97,27.94
N$285  (via drill 0.8 pad 1.9)
  other vias: 74.97,25.4
N$286  (via drill 0.8 pad 1.9)
  other vias: 72.43,25.4
N$287  (via drill 0.8 pad 1.9)
  other vias: 69.89,25.4
N$288  (via drill 0.8 pad 1.9)
  other vias: 67.35,25.4
N$289  (via drill 0.8 pad 1.9)
  other vias: 64.81,25.4
N$290  (via drill 0.8 pad 1.9)
  other vias: 62.27,25.4
N$291  (via drill 0.8 pad 1.9)
  other vias: 59.73,25.4
N$292  (via drill 0.8 pad 1.9)
  other vias: 57.19,25.4
N$293  (via drill 0.8 pad 1.9)
  other vias: 54.65,25.4
N$294  (via drill 0.8 pad 1.9)
  other vias: 52.11,25.4
N$295  (via drill 0.8 pad 1.9)
  other vias: 49.57,25.4
N$296  (via drill 0.8 pad 1.9)
  other vias: 47.03,25.4
N$297  (via drill 0.8 pad 1.9)
  other vias: 44.49,25.4
N$298  (via drill 0.8 pad 1.9)
  other vias: 41.95,25.4
N$299  (via drill 0.8 pad 1.9)
  other vias: 39.41,25.4
N$300  (via drill 0.8 pad 1.9)
  other vias: 36.87,25.4
N$301  (via drill 0.8 pad 1.9)
  other vias: 31.79,25.4
N$302  (via drill 0.8 pad 1.9)
  other vias: 34.33,25.4
N$303  (via drill 0.8 pad 1.9)
  other vias: 29.25,25.4
N$304  (via drill 0.8 pad 1.9)
  other vias: 26.71,25.4
N$305  (via drill 0.8 pad 1.9)
  other vias: 24.17,25.4
N$306  (via drill 0.8 pad 1.9)
  other vias: 21.63,25.4
N$307  (via drill 0.8 pad 1.9)
  other vias: 19.09,25.4
N$308  (via drill 0.8 pad 1.9)
  other vias: 16.55,25.4
N$309  (via drill 0.8 pad 1.9)
  other vias: 14.01,25.4
N$310  (via drill 0.8 pad 1.9)
  other vias: 11.47,25.4
N$311  (via drill 0.8 pad 1.9)
  other vias: 8.93,25.4
N$312  (via drill 0.8 pad 1.9)
  other vias: 6.39,25.4
N$313  (via drill 0.8 pad 1.9)
  other vias: 6.39,22.86
N$314  (via drill 0.8 pad 1.9)
  other vias: 8.93,22.86
N$315  (via drill 0.8 pad 1.9)
  other vias: 11.47,22.86
N$316  (via drill 0.8 pad 1.9)
  other vias: 14.01,22.86
N$317  (via drill 0.8 pad 1.9)
  other vias: 16.55,22.86
N$318  (via drill 0.8 pad 1.9)
  other vias: 19.09,22.86
N$319  (via drill 0.8 pad 1.9)
  other vias: 21.63,22.86
N$320  (via drill 0.8 pad 1.9)
  other vias: 24.17,22.86
N$321  (via drill 0.8 pad 1.9)
  other vias: 26.71,22.86
N$322  (via drill 0.8 pad 1.9)
  other vias: 29.25,22.86
N$323  (via drill 0.8 pad 1.9)
  other vias: 31.79,22.86
N$324  (via drill 0.8 pad 1.9)
  other vias: 34.33,22.86
N$325  (via drill 0.8 pad 1.9)
  other vias: 36.87,22.86
N$326  (via drill 0.8 pad 1.9)
  other vias: 39.41,22.86
N$327  (via drill 0.8 pad 1.9)
  other vias: 41.95,22.86
N$328  (via drill 0.8 pad 1.9)
  other vias: 44.49,22.86
N$329  (via drill 0.8 pad 1.9)
  other vias: 47.03,22.86
N$330  (via drill 0.8 pad 1.9)
  other vias: 49.57,22.86
N$331  (via drill 0.8 pad 1.9)
  other vias: 52.11,22.86
N$332  (via drill 0.8 pad 1.9)
  other vias: 54.65,22.86
N$333  (via drill 0.8 pad 1.9)
  other vias: 57.19,22.86
N$334  (via drill 0.8 pad 1.9)
  other vias: 59.73,22.86
N$335  (via drill 0.8 pad 1.9)
  other vias: 62.27,22.86
N$336  (via drill 0.8 pad 1.9)
  other vias: 64.81,22.86
N$337  (via drill 0.8 pad 1.9)
  other vias: 67.35,22.86
N$338  (via drill 0.8 pad 1.9)
  other vias: 69.89,22.86
N$339  (via drill 0.8 pad 1.9)
  other vias: 72.43,22.86
N$340  (via drill 0.8 pad 1.9)
  other vias: 74.97,22.86
N$341  (via drill 0.8 pad 1.9)
  other vias: 74.97,20.32
N$342  (via drill 0.8 pad 1.9)
  other vias: 72.43,20.32
N$343  (via drill 0.8 pad 1.9)
  other vias: 69.89,20.32
N$344  (via drill 0.8 pad 1.9)
  other vias: 67.35,20.32
N$345  (via drill 0.8 pad 1.9)
  other vias: 64.81,20.32
N$346  (via drill 0.8 pad 1.9)
  other vias: 62.27,20.32
N$347  (via drill 0.8 pad 1.9)
  other vias: 59.73,20.32
N$348  (via drill 0.8 pad 1.9)
  other vias: 57.19,20.32
N$349  (via drill 0.8 pad 1.9)
  other vias: 54.65,20.32
N$350  (via drill 0.8 pad 1.9)
  other vias: 52.11,20.32
N$351  (via drill 0.8 pad 1.9)
  other vias: 49.57,20.32
N$352  (via drill 0.8 pad 1.9)
  other vias: 47.03,20.32
N$353  (via drill 0.8 pad 1.9)
  other vias: 44.49,20.32
N$354  (via drill 0.8 pad 1.9)
  other vias: 41.95,20.32
N$355  (via drill 0.8 pad 1.9)
  other vias: 39.41,20.32
N$356  (via drill 0.8 pad 1.9)
  other vias: 36.87,20.32
N$357  (via drill 0.8 pad 1.9)
  other vias: 34.33,20.32
N$358  (via drill 0.8 pad 1.9)
  other vias: 31.79,20.32
N$359  (via drill 0.8 pad 1.9)
  other vias: 29.25,20.32
N$360  (via drill 0.8 pad 1.9)
  other vias: 26.71,20.32
N$361  (via drill 0.8 pad 1.9)
  other vias: 24.17,20.32
N$362  (via drill 0.8 pad 1.9)
  other vias: 21.63,20.32
N$363  (via drill 0.8 pad 1.9)
  other vias: 19.09,20.32
N$364  (via drill 0.8 pad 1.9)
  other vias: 16.55,20.32
N$365  (via drill 0.8 pad 1.9)
  other vias: 14.01,20.32
N$366  (via drill 0.8 pad 1.9)
  other vias: 11.47,20.32
N$367  (via drill 0.8 pad 1.9)
  other vias: 8.93,20.32
N$368  (via drill 0.8 pad 1.9)
  other vias: 6.39,20.32
N$369  (via drill 0.8 pad 1.9)
  other vias: 6.39,17.78
N$370  (via drill 0.8 pad 1.9)
  other vias: 8.93,17.78
N$371  (via drill 0.8 pad 1.9)
  other vias: 11.47,17.78
N$372  (via drill 0.8 pad 1.9)
  other vias: 14.01,17.78
N$373  (via drill 0.8 pad 1.9)
  other vias: 16.55,17.78
N$374  (via drill 0.8 pad 1.9)
  other vias: 19.09,17.78
N$375  (via drill 0.8 pad 1.9)
  other vias: 21.63,17.78
N$376  (via drill 0.8 pad 1.9)
  other vias: 24.17,17.78
N$377  (via drill 0.8 pad 1.9)
  other vias: 26.71,17.78
N$378  (via drill 0.8 pad 1.9)
  other vias: 29.25,17.78
N$379  (via drill 0.8 pad 1.9)
  other vias: 31.79,17.78
N$380  (via drill 0.8 pad 1.9)
  other vias: 34.33,17.78
N$381  (via drill 0.8 pad 1.9)
  other vias: 36.87,17.78
N$382  (via drill 0.8 pad 1.9)
  other vias: 39.41,17.78
N$383  (via drill 0.8 pad 1.9)
  other vias: 41.95,17.78
N$384  (via drill 0.8 pad 1.9)
  other vias: 44.49,17.78
N$385  (via drill 0.8 pad 1.9)
  other vias: 47.03,17.78
N$386  (via drill 0.8 pad 1.9)
  other vias: 49.57,17.78
N$387  (via drill 0.8 pad 1.9)
  other vias: 52.11,17.78
N$388  (via drill 0.8 pad 1.9)
  other vias: 54.65,17.78
N$389  (via drill 0.8 pad 1.9)
  other vias: 57.19,17.78
N$390  (via drill 0.8 pad 1.9)
  other vias: 59.73,17.78
N$391  (via drill 0.8 pad 1.9)
  other vias: 62.27,17.78
N$392  (via drill 0.8 pad 1.9)
  other vias: 64.81,17.78
N$393  (via drill 0.8 pad 1.9)
  other vias: 67.35,17.78
N$394  (via drill 0.8 pad 1.9)
  other vias: 69.89,17.78
N$395  (via drill 0.8 pad 1.9)
  other vias: 72.43,17.78
N$396  (via drill 0.8 pad 1.9)
  other vias: 74.97,17.78
N$397  (via drill 0.8 pad 1.9)
  other vias: 74.97,15.24
N$398  (via drill 0.8 pad 1.9)
  other vias: 72.43,15.24
N$399  (via drill 0.8 pad 1.9)
  other vias: 69.89,15.24
N$400  (via drill 0.8 pad 1.9)
  other vias: 67.35,15.24
N$401  (via drill 0.8 pad 1.9)
  other vias: 64.81,15.24
N$402  (via drill 0.8 pad 1.9)
  other vias: 62.27,15.24
N$403  (via drill 0.8 pad 1.9)
  other vias: 59.73,15.24
N$404  (via drill 0.8 pad 1.9)
  other vias: 57.19,15.24
N$405  (via drill 0.8 pad 1.9)
  other vias: 54.65,15.24
N$406  (via drill 0.8 pad 1.9)
  other vias: 52.11,15.24
N$407  (via drill 0.8 pad 1.9)
  other vias: 49.57,15.24
N$408  (via drill 0.8 pad 1.9)
  other vias: 47.03,15.24
N$409  (via drill 0.8 pad 1.9)
  other vias: 44.49,15.24
N$410  (via drill 0.8 pad 1.9)
  other vias: 41.95,15.24
N$411  (via drill 0.8 pad 1.9)
  other vias: 39.41,15.24
N$412  (via drill 0.8 pad 1.9)
  other vias: 36.87,15.24
N$413  (via drill 0.8 pad 1.9)
  other vias: 34.33,15.24
N$414  (via drill 0.8 pad 1.9)
  other vias: 31.79,15.24
N$415  (via drill 0.8 pad 1.9)
  other vias: 29.25,15.24
N$416  (via drill 0.8 pad 1.9)
  other vias: 26.71,15.24
N$417  (via drill 0.8 pad 1.9)
  other vias: 24.17,15.24
N$418  (via drill 0.8 pad 1.9)
  other vias: 21.63,15.24
N$419  (via drill 0.8 pad 1.9)
  other vias: 19.09,15.24
N$420  (via drill 0.8 pad 1.9)
  other vias: 14.01,15.24
N$421  (via drill 0.8 pad 1.9)
  other vias: 16.55,15.24
N$422  (via drill 0.8 pad 1.9)
  other vias: 11.47,15.24
N$423  (via drill 0.8 pad 1.9)
  other vias: 8.93,15.24
N$424  (via drill 0.8 pad 1.9)
  other vias: 6.39,15.24
N$433  (via drill 0.8 pad 1.9)
  other vias: 26.71,12.7
N$434  (via drill 0.8 pad 1.9)
  other vias: 29.25,12.7
N$435  (via drill 0.8 pad 1.9)
  other vias: 31.79,12.7
N$436  (via drill 0.8 pad 1.9)
  other vias: 34.33,12.7
N$437  (via drill 0.8 pad 1.9)
  other vias: 36.87,12.7
N$438  (via drill 0.8 pad 1.9)
  other vias: 39.41,12.7
N$439  (via drill 0.8 pad 1.9)
  other vias: 41.95,12.7
N$440  (via drill 0.8 pad 1.9)
  other vias: 44.49,12.7
N$441  (via drill 0.8 pad 1.9)
  other vias: 47.03,12.7
N$442  (via drill 0.8 pad 1.9)
  other vias: 49.57,12.7
N$443  (via drill 0.8 pad 1.9)
  other vias: 52.11,12.7
N$444  (via drill 0.8 pad 1.9)
  other vias: 54.65,12.7
N$445  (via drill 0.8 pad 1.9)
  other vias: 57.19,12.7
N$446  (via drill 0.8 pad 1.9)
  other vias: 59.73,12.7
N$447  (via drill 0.8 pad 1.9)
  other vias: 62.27,12.7
N$448  (via drill 0.8 pad 1.9)
  other vias: 64.81,12.7
N$449  (via drill 0.8 pad 1.9)
  other vias: 67.35,12.7
N$450  (via drill 0.8 pad 1.9)
  other vias: 69.89,12.7
N$451  (via drill 0.8 pad 1.9)
  other vias: 72.43,12.7
N$452  (via drill 0.8 pad 1.9)
  other vias: 74.97,12.7
N$453  (via drill 0.8 pad 1.9)
  other vias: 74.97,10.16
N$454  (via drill 0.8 pad 1.9)
  other vias: 72.43,10.16
N$455  (via drill 0.8 pad 1.9)
  other vias: 69.89,10.16
N$456  (via drill 0.8 pad 1.9)
  other vias: 67.35,10.16
N$457  (via drill 0.8 pad 1.9)
  other vias: 64.81,10.16
N$458  (via drill 0.8 pad 1.9)
  other vias: 62.27,10.16
N$459  (via drill 0.8 pad 1.9)
  other vias: 57.19,10.16
N$460  (via drill 0.8 pad 1.9)
  other vias: 59.73,10.16
N$461  (via drill 0.8 pad 1.9)
  other vias: 54.65,10.16
N$462  (via drill 0.8 pad 1.9)
  other vias: 52.11,10.16
N$463  (via drill 0.8 pad 1.9)
  other vias: 49.57,10.16
N$464  (via drill 0.8 pad 1.9)
  other vias: 47.03,10.16
N$465  (via drill 0.8 pad 1.9)
  other vias: 44.49,10.16
N$466  (via drill 0.8 pad 1.9)
  other vias: 41.95,10.16
N$467  (via drill 0.8 pad 1.9)
  other vias: 39.41,10.16
N$468  (via drill 0.8 pad 1.9)
  other vias: 36.87,10.16
N$469  (via drill 0.8 pad 1.9)
  other vias: 34.33,10.16
N$470  (via drill 0.8 pad 1.9)
  other vias: 31.79,10.16
N$471  (via drill 0.8 pad 1.9)
  other vias: 29.25,10.16
N$472  (via drill 0.8 pad 1.9)
  other vias: 26.71,10.16
N$481  (via drill 0.8 pad 1.9)
  other vias: 77.51,5.08
N$482  (via drill 0.8 pad 1.9)
  other vias: 74.97,5.08
N$483  (via drill 0.8 pad 1.9)
  other vias: 72.43,5.08
N$484  (via drill 0.8 pad 1.9)
  other vias: 69.89,5.08
N$485
  Top 0.813: J1.D15 U$1.P$1
N$486
  Top 0.813: J1.D14 U$2.P$1
N$487  (via drill 0.8 pad 1.9)
  other vias: 74.97,2.54
N$488  (via drill 0.8 pad 1.9)
  other vias: 77.51,2.54
N$489
  Top 0.813: J1.AVDD U$3.P$1
N$490
  Top 0.813: J1.GND_D U$4.P$1
N$491  (via drill 0.8 pad 1.9)
  other vias: 74.97,50.8
N$492  (via drill 0.8 pad 1.9)
  other vias: 77.51,50.8
N$493  (via drill 0.8 pad 1.9)
  other vias: 77.51,48.26
N$494  (via drill 0.8 pad 1.9)
  other vias: 74.97,48.26
N$495  (via drill 0.8 pad 1.9)
  other vias: 72.43,48.26
N$496  (via drill 0.8 pad 1.9)
  other vias: 69.89,48.26
N$497
  Top 0.813: J1.D13 U$5.P$1
N$507  (via drill 0.8 pad 1.9)
  other vias: 26.71,5.08
N$508  (via drill 0.8 pad 1.9)
  other vias: 29.25,5.08
N$509  (via drill 0.8 pad 1.9)
  other vias: 31.79,5.08
N$510
  Top 0.813: J1.D12 U$6.P$1
N$511
  Top 0.813: J1.D11 U$7.P$1
N$512
  Top 0.813: J1.D10 U$8.P$1
N$513
  Top 0.813: J1.D9 U$9.P$1
N$514
  Top 0.813: J1.D8 U$10.P$1
N$515
  Top 0.813: J1.D7 U$11.P$1
N$516
  Top 0.813: J1.D6 U$12.P$1
N$517
  Top 0.813: J1.D5 U$13.P$1
N$518
  Top 0.813: J1.D4 U$14.P$1
N$519
  Top 0.813: J1.D3 U$15.P$1
N$520
  Top 0.813: J1.D2 U$16.P$1
N$521
  Top 0.813: J1.D1 U$17.P$1
N$522
  Top 0.813: J1.D0 U$18.P$1
N$523
  Top 0.813: J1.IOREF U$19.P$1
N$524
  Top 0.813: J1.RST U$20.P$1
N$525
  Top 0.813: J1.3V3 U$21.P$1
N$526
  Top 0.813: J1.5V U$22.P$1
N$527
  Top 0.813: J1.GND@2 U$23.P$1
N$528
  Top 0.813: J1.GND@1 U$24.P$1
N$529
  Top 0.813: J1.VIN U$25.P$1
N$530
  Top 0.813: J1.A5 U$26.P$1
N$531
  Top 0.813: J1.A4 U$27.P$1
N$532
  Top 0.813: J1.A3 U$28.P$1
N$533
  Top 0.813: J1.A2 U$29.P$1
N$534
  Top 0.813: J1.A1 U$30.P$1
N$535
  Top 0.813: J1.A0 U$31.P$1
N$536
  Bottom 0.406: Q1.C 6.39,44.28 U$32.P$1
N$537
  Bottom 0.406: Q1.B 8.93,40.49 U$33.P$1
N$538
  Bottom 0.406: Q1.E 6.39,40.49 U$34.P$1
N$539
  Bottom 0.406: Q2.C U$35.P$1
N$540
  Bottom 0.406: Q2.B 8.93,44.6 U$37.P$1
N$541
  Bottom 0.406: Q2.E 11.47,43.96 U$36.P$1
N$542
  Bottom 0.406: Q3.C 14.01,44.28 U$38.P$1
N$543
  Bottom 0.406: Q3.B 16.55,40.49 U$40.P$1
N$544
  Bottom 0.406: Q3.E 14.01,40.49 U$39.P$1
N$545
  Top 0.203: U$41.P$8 8.62,5.61 6.89,3.88 5.05,3.88 U$48.P$1
  Bottom 0.203: U$58.P$9 7.46,4.45 6.89,3.88 5.05,3.88 U$48.P$1

### Text on the board
tPlace: KCs PS0v1.0 | STM32 DISCO Proto Shield
bStop: github.com/kcs/stm-disco-proto